# EAGLE design Drawdio_v10 (EAGLE 6.6.0)
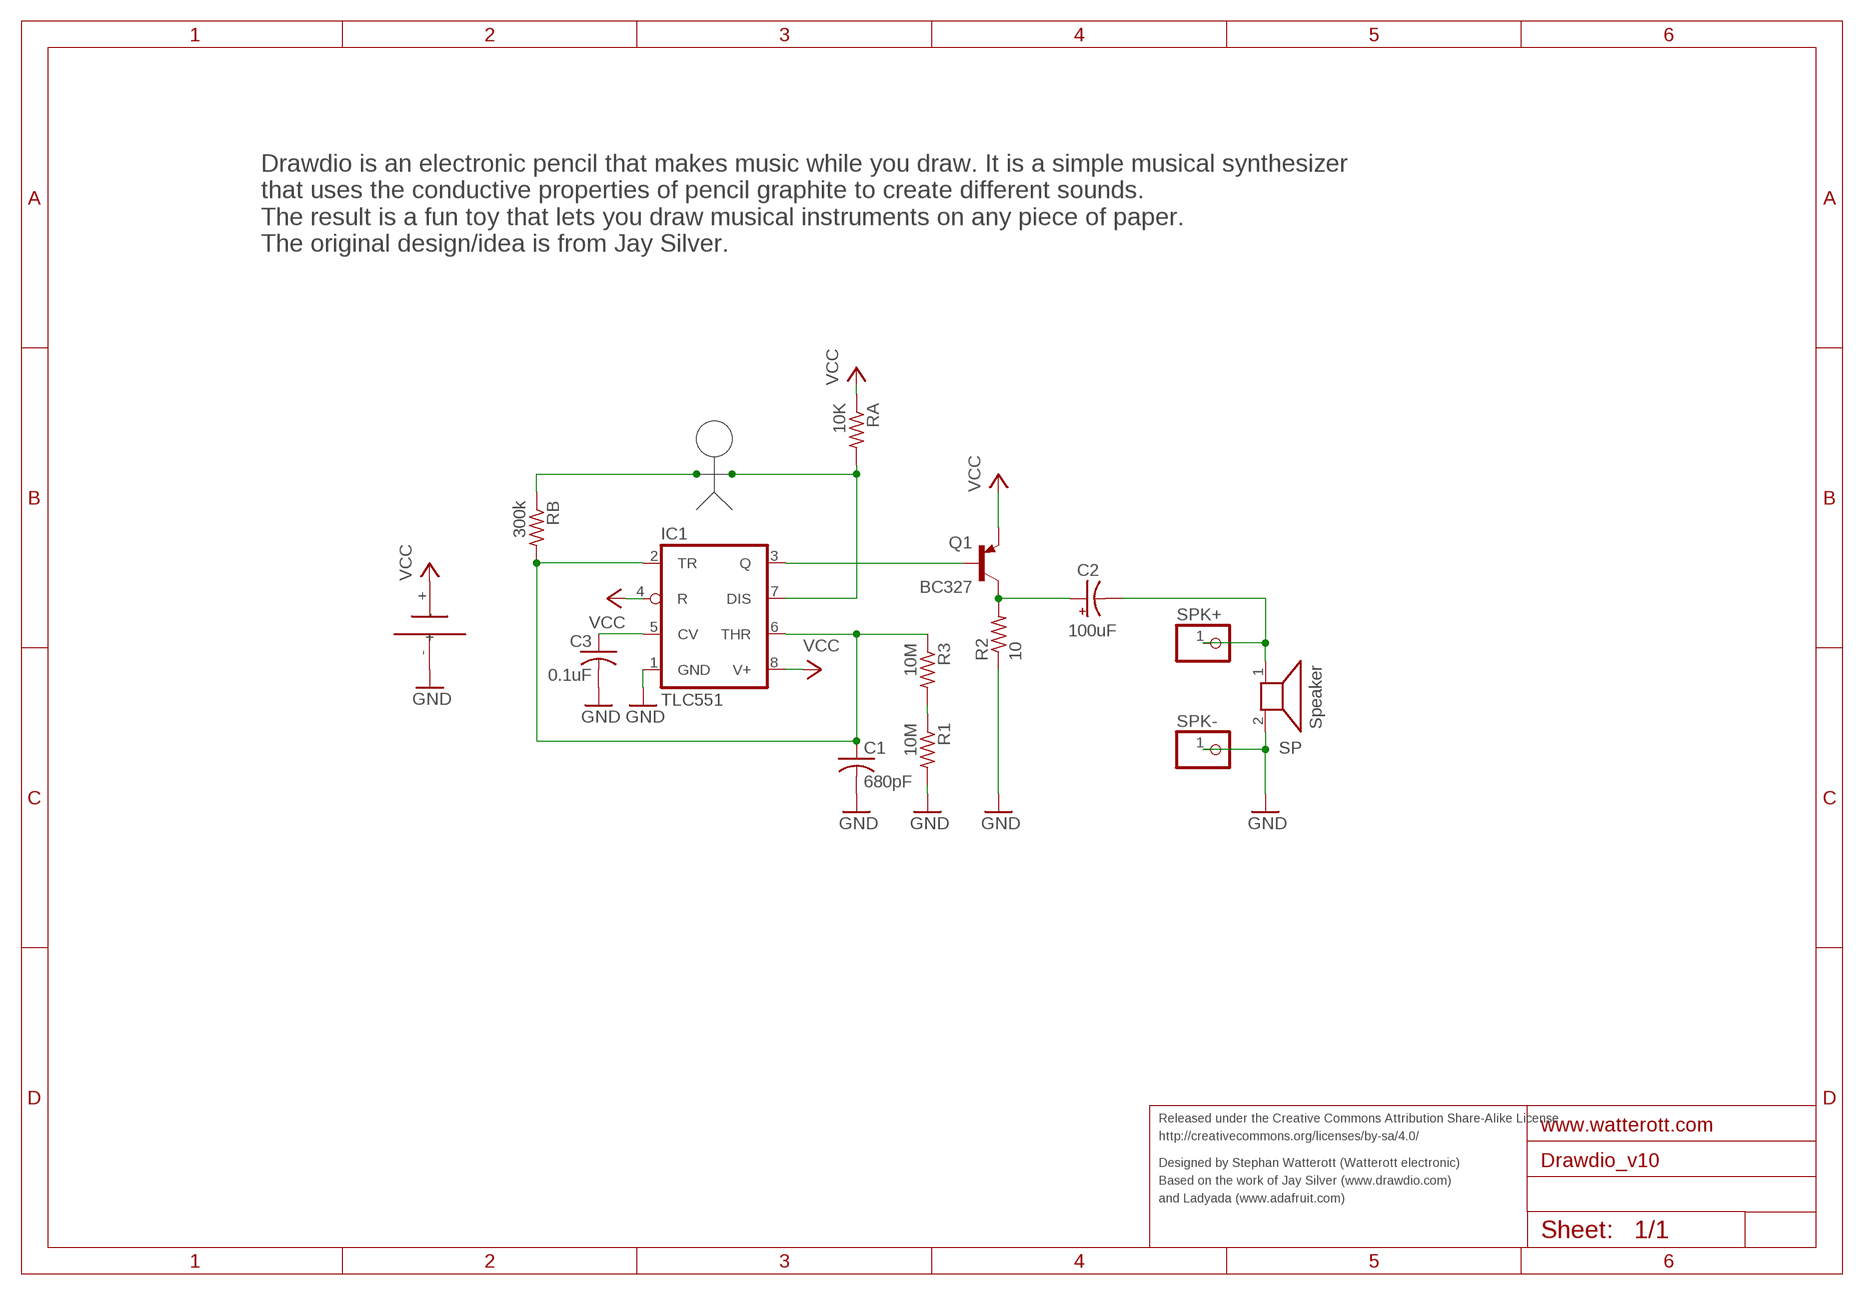
[diagram p0: schematic, sheet 1]

## Parts
C1  680pF  C-US025-025X050  [C025-025X050]
C2  100uF  CPOL-USE2.5-5  [E2,5-5]
C3  0.1uF  C-US025-025X050  [C025-025X050]
IC1  TLC551  NE555N  [DIL08]
Q1  BC327  MPS2907A-PNP-TO92-CBE  [TO92-CBE]
R1  10M  R-US_0207/10  [0207/10]
R2  10  R-US_0207/10  [0207/10]
R3  10M  R-US_0207/10  [0207/10]
RA  10K  R-US_0207/10  [0207/10]
RB  300k  R-US_0207/10  [0207/10]
SP  Speaker  PS603SPK  [PS603]
SPK+  PINHD-1X1  [1X01]
SPK-  PINHD-1X1  [1X01]
U$1  AAA  [AAA]

## Nets
GND: C1.2 C3.2 IC1.1(GND) R1.2 R2.1 SP.2 SPK-.1 U$1.-
N$1: C3.1 IC1.5(CV)
N$2: IC1.3(Q) Q1.B
N$3: C2.+ Q1.C R2.2
N$4: C1.1 IC1.2(TR) IC1.6(THR) R3.1 RB.2
N$5: RB.1
N$6: IC1.7(DIS) RA.2
N$7: C2.- SP.1 SPK+.1
N$8: R1.1 R3.2
VCC: IC1.4(R) IC1.8(V+) Q1.E RA.1 U$1.+

## Notes on the sheet
- Drawdio is an electronic pencil that makes music while you draw. It is a simple musical synthesizer 
  that uses the conductive properties of pencil graphite to create different sounds.
  The result is a fun toy that lets you draw musical instruments on any piece of paper.
  The original design/idea is from Jay Silver.
- Released under the Creative Commons Attribution Share-Alike License
- http://creativecommons.org/licenses/by-sa/4.0/
- Designed by Stephan Watterott (Watterott electronic)
- Based on the work of Jay Silver (www.drawdio.com)
- and Ladyada (www.adafruit.com)

## Library data of the parts
C1 C3 = rcl-ez:C-US: CAPACITOR, American symbol
C2 = rcl-ez:CPOL-US: POLARIZED CAPACITOR, American symbol
IC1 = drawdio:*555: TIMER
Q1 = transistor:*-PNP-: PNP Transistror
R1-R3 RA RB = rcl-ez:R-US_: RESISTOR, American symbol
SP = drawdio:PS603
SPK+ SPK- = ybox2:PINHD-1X1: PIN HEADER
U$1 = drawdio:AAA

## Board
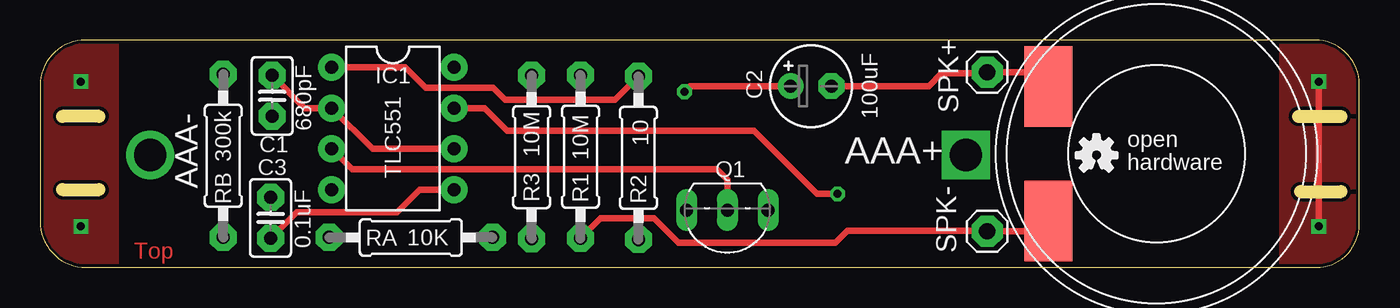
[diagram p1: board, top side]
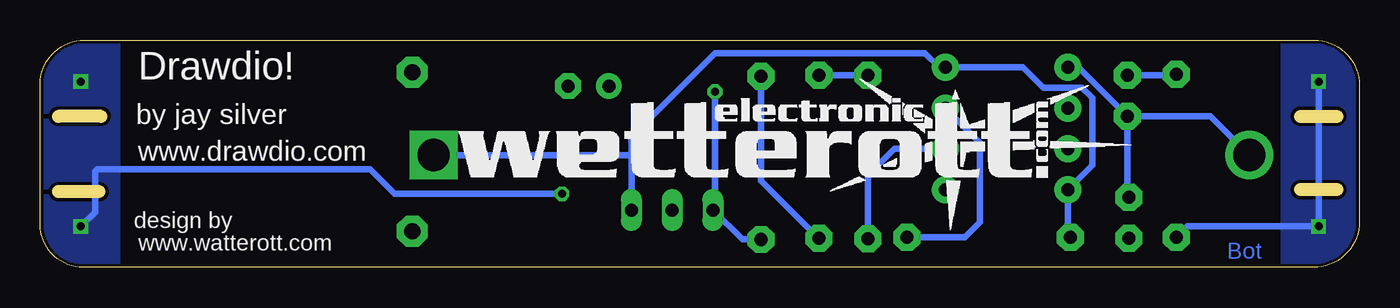
[diagram p2: board, bottom side, seen from below]

Size 82.15 x 14.15 mm. Coordinates in mm from the lower left corner, seen from the top.
Outline: 3.68,9.41 1.39,9.41
Outline: 1.39,4.84 3.68,4.84
Outline: 78.35,9.41 81.02,9.41
Outline: 78.48,4.71 81.02,4.71
Outline: 82.15,11.4 arc90 79.4,14.15 2.83,14.15 arc90 0,11.32 0,2.86 arc90 2.86,0 79.45,0 arc90 82.15,2.7 82.15,11.4
Copper layers (1*16): Top 0.035mm / dielectric 1.5mm / Bottom 0.035mm
Design rules "default *": minimum track width 0.15mm, minimum drill 0.3mm, track to track 0.15mm, track to pad 0.15mm, pad to pad 0.15mm, via to via 0.15mm, smd to smd 0mil, copper to edge 8mil, drill to drill 8mil, minimum pad ring 10mil, minimum via ring 8mil, stop-mask expansion 4mil, vias tented up to drill 0.5mm, thermal gap 10mil

### Footprints (pad centres in the part's own frame; a part is rotated, then mirrored left to right if it is on the bottom)
C025-025X050 = drill 0.813 pad 1.676 octagon: 1 -1.27,0; 2 1.27,0
E2,5-5 = drill 0.813 pad 1.6: + -1.27,0 | drill 0.813 pad 1.6 octagon: - 1.27,0
DIL08 = drill 0.813 pad 1.676: 1 -3.81,-3.81; 2 -1.27,-3.81; 3 1.27,-3.81; 4 3.81,-3.81; 5 3.81,3.81; 6 1.27,3.81; 7 -1.27,3.81; 8 -3.81,3.81
TO92-CBE = drill 0.813 long: B 0,0; C 2.54,0; E -2.54,0
0207/10 = drill 0.813 pad 1.676 octagon: 1 -5.08,0; 2 5.08,0
PS603 = smd 5 x 3: 1 -4.184,-6.738; 2 4.184,-6.738
1X01 = drill 1.016 pad 1.93 octagon: 1 0,0
AAA = drill 2 square: + -25.4,0 | drill 2: - 25.4,0

### Placement (x,y rotation side)
C1  14.45,10.68 270 top
C2  48,11.29 0 top
C3  14.35,3.09 90 top
IC1  21.97,8.65 270 top
Q1  42.79,3.57 180 top
R1  33.65,6.9 270 top
R2  37.26,6.82 270 top
R3  30.6,6.87 90 top
RA  23.08,1.87 0 top
RB  11.4,6.95 90 top
SP  69.51,7.07 270 top
SPK+  58.97,12.15 0 top
SPK-  58.97,2.25 0 top
U$1  32.25,7 180 top
U$2  WE-LOGO  [WE-LOGO]  56.38,1.98 0 bottom

### Tracks (layer width: path | path; a pad name or v marks a point on that pad's centre or on a via)
GND
  Top 0.406: R2.1 35.78,10.43 28.95,10.43 28.19,11.19 24,11.19 22.73,12.46 IC1.1 | R1.2 34.89,3.06 38.22,3.06 39.75,1.54 49.52,1.54 50.29,2.3 58.92,2.3 SPK-.1 62.13,2.25 SP.2
  Bottom 0.406: C1.2 9.27,9.41 U$1.- | C1.2 14.45,4.46 C3.2 | IC1.1 17.5,12.46 C1.2 | R1.2 33.67,1.82 37.26,5.4 R2.1
N$1
  Top 0.406: C3.1 15.97,3.44 22.22,3.44 23.62,4.84 IC1.5
N$2
  Top 0.406: IC1.3 19.43,6.11 42.16,6.11 42.79,5.47 Q1.B
N$3  (via drill 0.5)
  Top 0.406: C2.+ 40.48,11.29 v40.13,10.93
  Bottom 0.406: R2.2 38.42,1.74 Q1.C 40.13,3.7 v40.13,10.93
N$4
  Top 0.406: C1.1 16.48,9.92 IC1.2 20.7,7.38 IC1.6
  Bottom 0.406: C1.1 11.48,11.95 RB.2 | R3.1 30.6,5.73 28.95,7.38 IC1.6
N$5  (via drill 0.5)
  Bottom 0.406: v2.54,11.57 v2.54,2.55 10.71,2.55 RB.1
  pour Top: 4.69,13.98 0.12,13.98 0.12,0.27 4.69,0.27
  pour Bottom: 4.44,14.24 0.12,14.24 0.12,0.27 4.69,0.27 4.69,14.11 4.31,14.11
N$6  (via drill 0.5)
  Top 0.406: v79.62,11.57 v79.62,2.55 | v49.65,4.58 48.38,4.58 44.45,8.52 29.08,8.52 27.68,9.92 IC1.7
  Bottom 0.406: RA.2 24.56,1.87 23.62,2.81 23.62,7.76 IC1.7 | v49.65,4.58 60.07,4.58 61.59,6.11 78.61,6.11 78.73,5.98 78.73,3.44 v79.62,2.55
  pour Top: 81.91,13.98 77.34,13.98 77.34,0.27 81.91,0.27
  pour Bottom: 81.66,14.24 77.34,14.24 77.34,0.27 81.91,0.27 81.91,14.11 81.53,14.11
N$7
  Top 0.406: C2.- 55.34,11.29 56.13,12.08 58.9,12.08 SPK+.1 62.78,12.15 SP.1
N$8
  Bottom 0.406: R1.1 33.62,11.95 R3.2
VCC
  Bottom 0.406: RA.1 18.16,2.02 IC1.4 16.63,6.36 16.63,10.55 17.27,11.19 19.68,11.19 20.95,12.46 IC1.8 26.16,12.46 27.05,13.35 40.13,13.35 45.33,8.14 45.33,7.12 45.33,7 | 45.33,7 Q1.E | U$1.+ 45.33,7

### Text on the board
Top: Top
Bottom: Bot
tPlace: SPK+ | AAA+ | open | hardware | AAA- | SPK-
bPlace: Drawdio! | by jay silver | www.drawdio.com | design by | www.watterott.com
Reference: Silkscreen: 21 tPlace + 22 bPlace